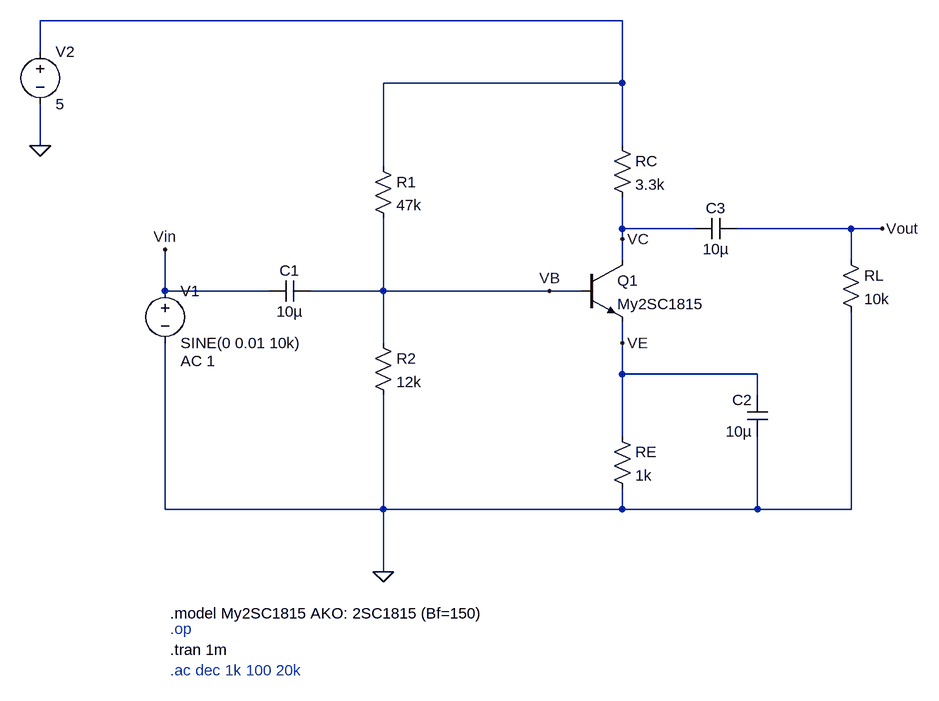
[diagram p0: schematic Draft4.asc]
Draft4.asc, the LTspice schematic file:
Version 4.1
SHEET 1 2904 712
WIRE 816 -304 -80 -304
WIRE -80 -256 -80 -304
WIRE 816 -208 816 -304
WIRE 816 -208 448 -208
WIRE -80 -112 -80 -176
WIRE 816 -112 816 -208
WIRE 448 -80 448 -208
WIRE 816 16 816 -32
WIRE 928 16 816 16
WIRE 1168 16 992 16
WIRE 1216 16 1168 16
WIRE 816 32 816 16
WIRE 816 64 816 32
WIRE 1168 64 1168 16
WIRE 112 112 112 48
WIRE 272 112 112 112
WIRE 448 112 448 0
WIRE 448 112 336 112
WIRE 704 112 448 112
WIRE 752 112 704 112
WIRE 448 192 448 112
WIRE 816 192 816 160
WIRE 816 240 816 192
WIRE 1024 240 816 240
WIRE 1024 272 1024 240
WIRE 816 336 816 240
WIRE 112 448 112 192
WIRE 448 448 448 272
WIRE 448 448 112 448
WIRE 816 448 816 416
WIRE 816 448 448 448
WIRE 1024 448 1024 336
WIRE 1024 448 816 448
WIRE 1168 448 1168 144
WIRE 1168 448 1024 448
WIRE 448 544 448 448
FLAG 448 544 0
FLAG 1216 16 Vout
FLAG 816 192 VE
FLAG 816 32 VC
FLAG 704 112 VB
FLAG -80 -112 0
FLAG 112 48 Vin
SYMBOL voltage 112 96 R0
WINDOW 123 24 124 Left 2
WINDOW 39 0 0 Left 0
SYMATTR Value2 AC 1
SYMATTR InstName V1
SYMATTR Value SINE(0 0.01 10k)
SYMBOL cap 336 96 R90
WINDOW 0 0 32 VBottom 2
WINDOW 3 32 32 VTop 2
SYMATTR InstName C1
SYMATTR Value 10µ
SYMBOL cap 1040 336 R180
WINDOW 0 24 56 Left 2
WINDOW 3 24 8 Left 2
SYMATTR InstName C2
SYMATTR Value 10µ
SYMBOL cap 928 32 R270
WINDOW 0 32 32 VTop 2
WINDOW 3 0 32 VBottom 2
SYMATTR InstName C3
SYMATTR Value 10µ
SYMBOL res 432 176 R0
SYMATTR InstName R2
SYMATTR Value 12k
SYMBOL res 432 -96 R0
SYMATTR InstName R1
SYMATTR Value 47k
SYMBOL res 800 -128 R0
SYMATTR InstName RC
SYMATTR Value 3.3k
SYMBOL res 800 320 R0
SYMATTR InstName RE
SYMATTR Value 1k
SYMBOL res 1152 48 R0
SYMATTR InstName RL
SYMATTR Value 10k
SYMBOL voltage -80 -272 R0
WINDOW 123 0 0 Left 0
WINDOW 39 0 0 Left 0
SYMATTR InstName V2
SYMATTR Value 5
SYMBOL npn 752 64 R0
SYMATTR InstName Q1
SYMATTR Value My2SC1815
TEXT 120 608 Left 2 !.model My2SC1815 AKO: 2SC1815 (Bf=150)
TEXT 120 632 Left 2 ;.op
TEXT 120 664 Left 2 !.tran 1m
TEXT 120 696 Left 2 ;.ac dec 1k 100 20k

The netlist it stands for:
* Draft4.asc
V1 Vin 0 SINE(0 0.01 10k) AC 1
C1 VB Vin 10µ
C2 0 VE 10µ
C3 VC Vout 10µ
R2 VB 0 12k
R1 N001 VB 47k
RC N001 VC 3.3k
RE VE 0 1k
RL Vout 0 10k
V2 N001 0 5
Q1 VC VB VE 0 My2SC1815
.model NPN NPN
.model PNP PNP
.lib standard.bjt
.model My2SC1815 AKO: 2SC1815 (Bf=150)
* .op
.tran 1m
* .ac dec 1k 100 20k
.backanno
.end